# EasyEDA schematic LumaPar.json
TITLE: Parcan Control PCB; REV: 1.0; Date: 2024-01-25; Sheet: 1/1; Company: AHSFA
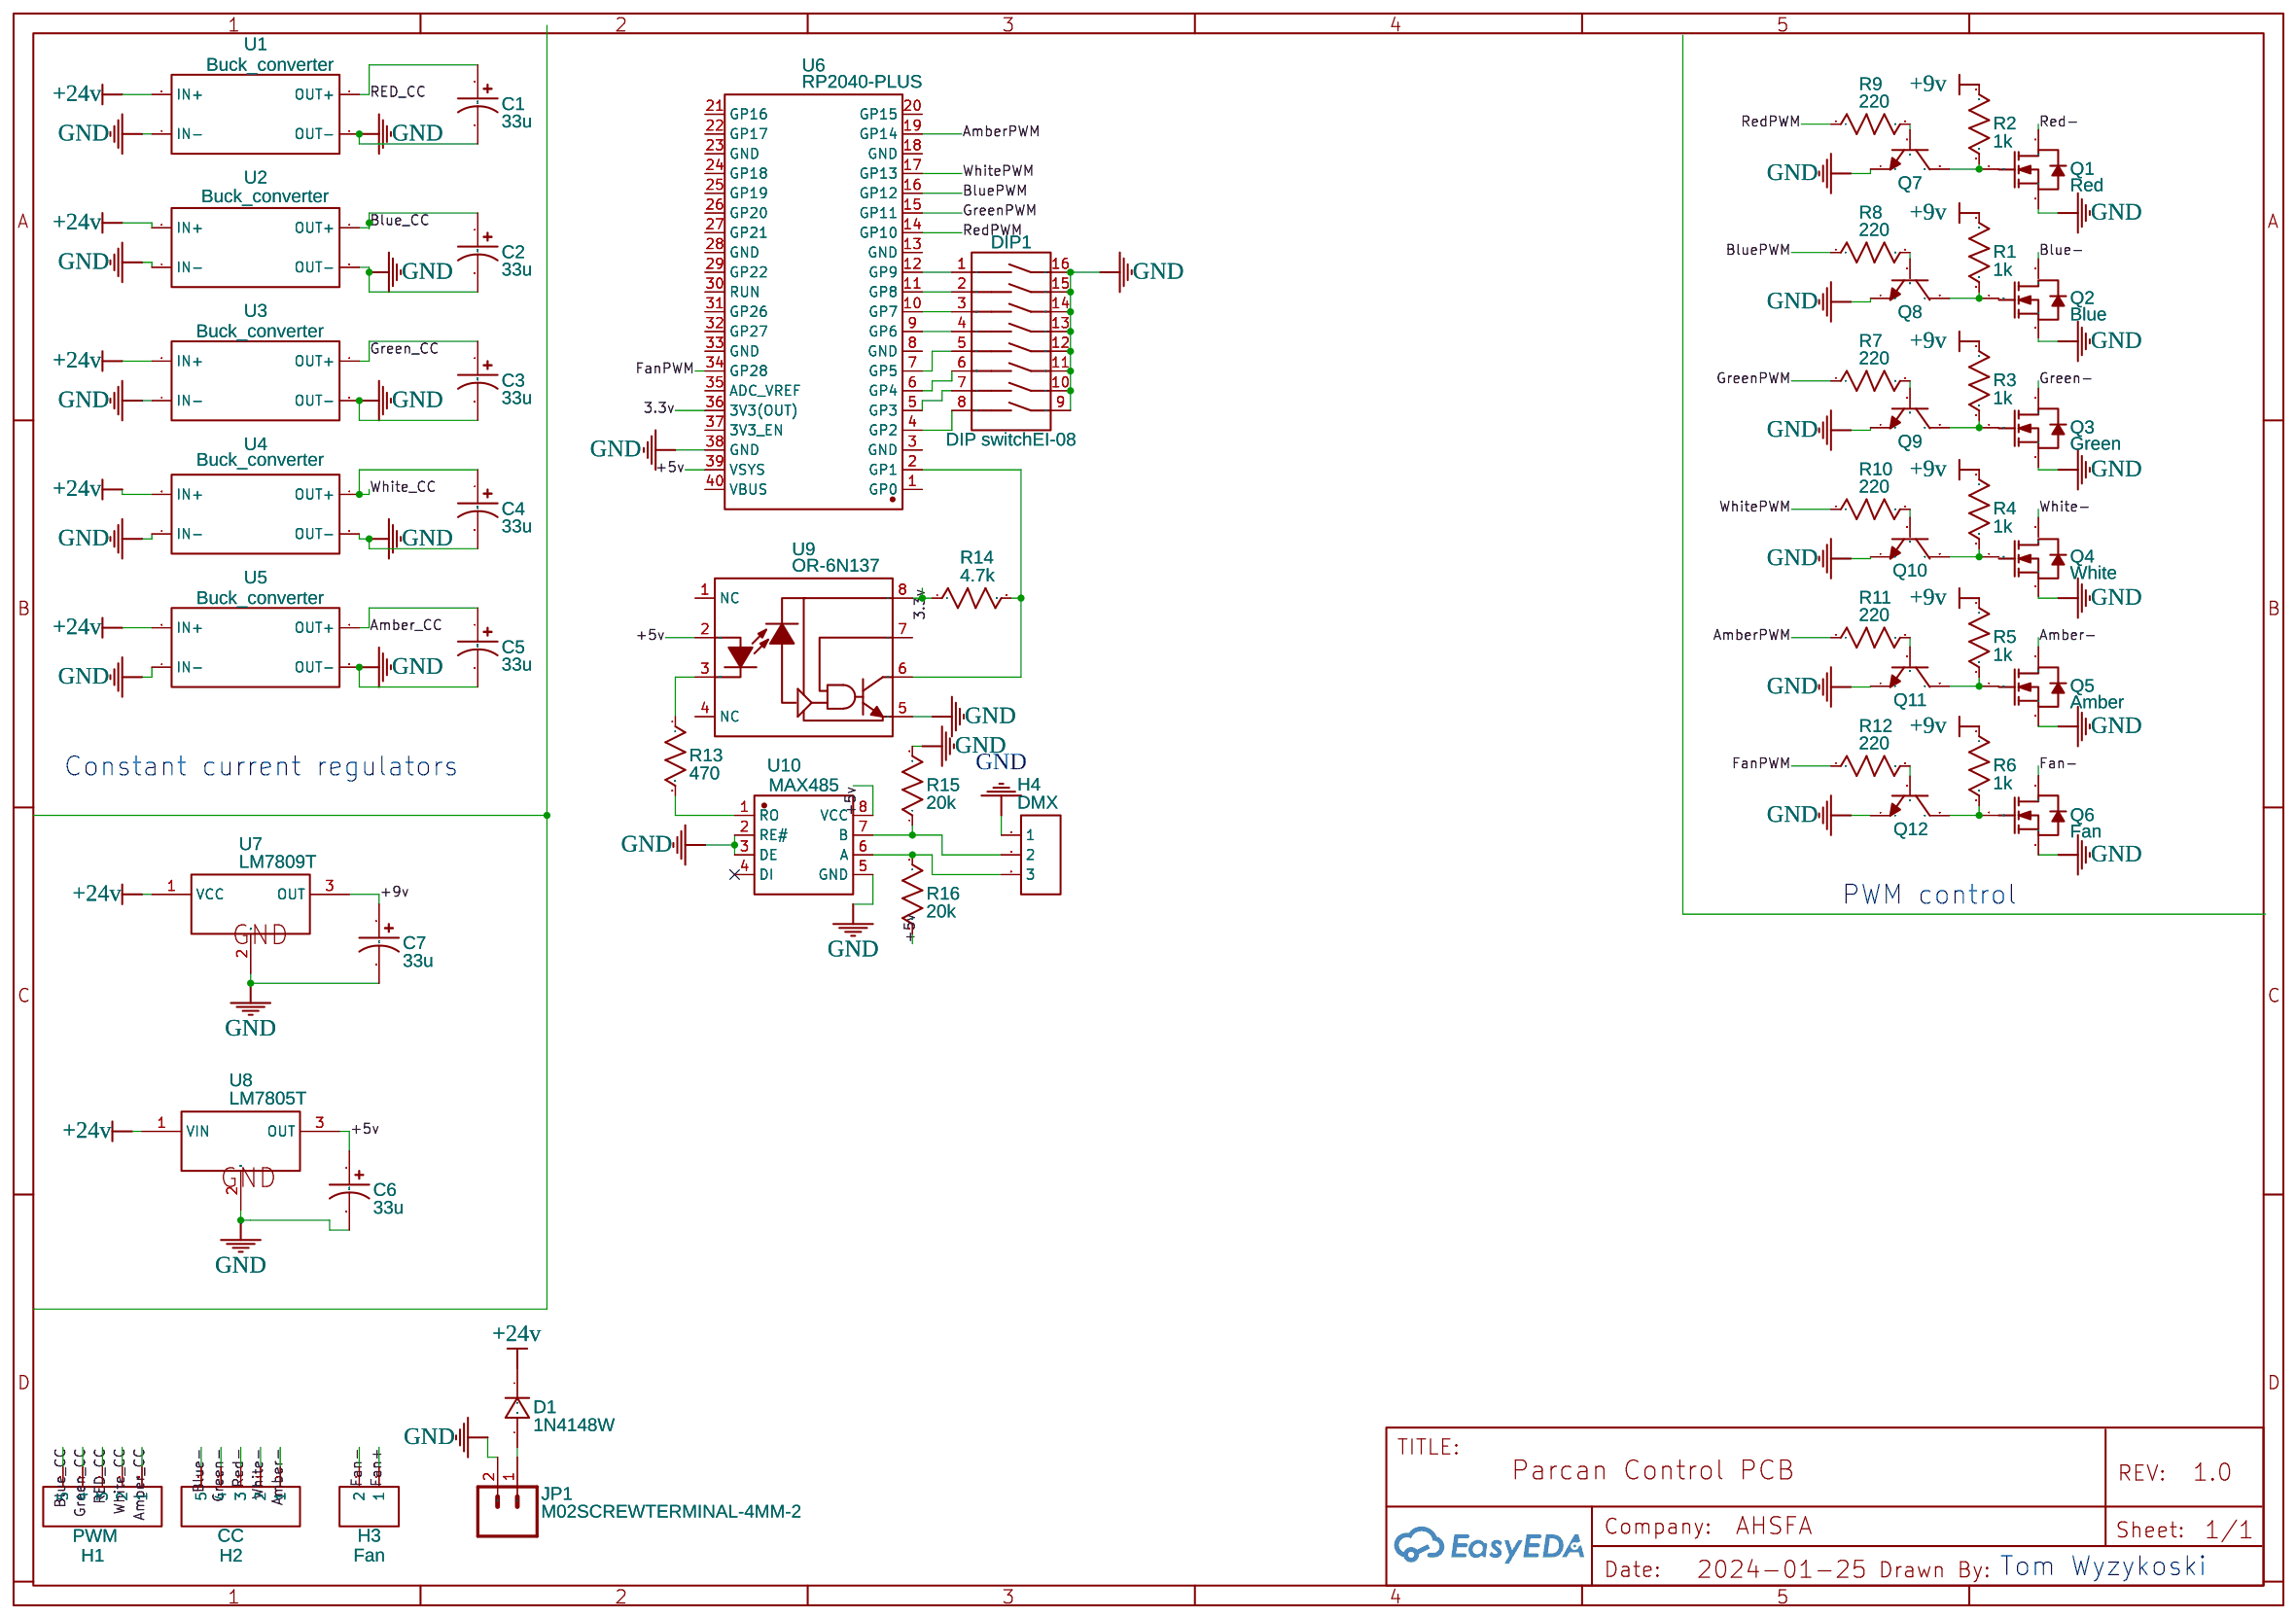
[diagram p0: schematic sheet]

## Parts
C1  33u  [CAP-D5.0×F2.0]
C2  33u  [CAP-D5.0×F2.0]
C3  33u  [CAP-D5.0×F2.0]
C4  33u  [CAP-D5.0×F2.0]
C5  33u  [CAP-D5.0×F2.0]
C6  33u  [CAP-D5.0×F2.0]
C7  33u  [CAP-D5.0×F2.0]
D1  1N4148W  [DO7]
DIP1  DIP switchEI-08  [SW-TH_16P-L20.5-W6.0-P2.54]
H1  PWM  [HDR-F-2.54_1X5]
H2  CC  [HDR-F-2.54_1X5]
H3  Fan  [HDR-F-2.54_1X2]
H4  DMX  [HDR-F-2.54_1X3]
JP1  M02SCREWTERMINAL-4MM-2  [SCREWTERMINAL-4MM-2]
Q1  Red  [D2PAK_L10.0-W9.0-P2.54-LS15.0-BR]
Q2  Blue  [D2PAK_L10.0-W9.0-P2.54-LS15.0-BR]
Q3  Green  [D2PAK_L10.0-W9.0-P2.54-LS15.0-BR]
Q4  White  [D2PAK_L10.0-W9.0-P2.54-LS15.0-BR]
Q5  Amber  [D2PAK_L10.0-W9.0-P2.54-LS15.0-BR]
Q6  Fan  [D2PAK_L10.0-W9.0-P2.54-LS15.0-BR]
Q7  SS8050_C717455  [TO-92-3_L4.9-W3.7-P1.27-L]
Q8  SS8050_C717455  [TO-92-3_L4.9-W3.7-P1.27-L]
Q9  SS8050_C717455  [TO-92-3_L4.9-W3.7-P1.27-L]
Q10  SS8050_C717455  [TO-92-3_L4.9-W3.7-P1.27-L]
Q11  SS8050_C717455  [TO-92-3_L4.9-W3.7-P1.27-L]
Q12  SS8050_C717455  [TO-92-3_L4.9-W3.7-P1.27-L]
R1  1k  [R_AXIAL-0.4]
R2  1k  [R_AXIAL-0.4]
R3  1k  [R_AXIAL-0.4]
R4  1k  [R_AXIAL-0.4]
R5  1k  [R_AXIAL-0.4]
R6  1k  [R_AXIAL-0.4]
R7  220  [R_AXIAL-0.4]
R8  220  [R_AXIAL-0.4]
R9  220  [R_AXIAL-0.4]
R10  220  [R_AXIAL-0.4]
R11  220  [R_AXIAL-0.4]
R12  220  [R_AXIAL-0.4]
R13  470  [R_AXIAL-0.4]
R14  4.7k  [R_AXIAL-0.4]
R15  20k  [R_AXIAL-0.4]
R16  20k  [R_AXIAL-0.4]
U1  Buck_converter  [BUCK-CONVERTER]
U2  Buck_converter  [BUCK-CONVERTER]
U3  Buck_converter  [BUCK-CONVERTER]
U4  Buck_converter  [BUCK-CONVERTER]
U5  Buck_converter  [BUCK-CONVERTER]
U6  RP2040-PLUS  [LCC-40_L51.0-W21.0-P2.54-BL_RP2040-BASED]
U7  LM7809T  [TO-220-3_L10.0-W4.5-P2.54-L]
U8  LM7805T  [TO-220-3_L10.0-W4.5-P2.54-L]
U9  OR-6N137  [DIP-8_L9.7-W6.5-P2.54-LS7.6-BL]
U10  MAX485  [PDIP-8_L9.3-W6.4-P2.54-LS7.9-BL-1]

## Library data of the parts
C1-C7 = CE_TH_D5.0×F2.0_US: Contributor: LCEDA_Lib
D1 = 1N4148W: Supplier: LCSC; Manufacturer: Tak Cheong; Contributor: LCEDA_Lib; Supplier Part: C129216
DIP1 = DIP switchEI-08: Supplier: LCSC; Manufacturer: 圜达; Manufacturer Part: EI-08-V; Supplier Part: C90019; JLCPCB Part Class: Extended Part
H1 H2 = HDR-F-2.54_1x5: Supplier Part: C50950; Supplier: LCSC; Contributor: LCEDA_Lib
H3 = HDR-F-2.54_1x2: Supplier Part: C49661; Supplier: LCSC; Contributor: LCEDA_Lib
H4 = HDR-F-2.54_1x3: Supplier Part: C146690; Supplier: LCSC; Contributor: LCEDA_Lib
JP1 = M02SCREWTERMINAL-4MM-2: Contributor: arg123dt
Q1-Q6 = IRLZ44NSTRLPBF: Contributor: LCSC; Supplier: LCSC; Supplier Part: C538199; Manufacturer: Infineon(英飞凌); JLCPCB Part Class: Extended Part
Q7-Q12 = SS8050_C717455: Contributor: LCSC; Supplier: LCSC; Supplier Part: C717455; Manufacturer: LGE(鲁光); Manufacturer Part: SS8050; JLCPCB Part Class: Extended Part
R1-R12 = R_0603_US: Contributor: LCEDA_Lib
R13-R16 = R_AXIAL-1.0_US: Contributor: LCEDA_Lib
U1-U5 = Buck_converter: Supplier: Tayda; Contributor: J.cruz
U6 = RP2040-PLUS: Supplier: LCSC; Supplier Part: C5374681; Manufacturer: Waveshare(微雪电子); Manufacturer Part: RP2040-Plus; JLCPCB Part Class: Extended Part
U7 = LM7809T: Contributor: LCSC; Supplier: LCSC; Supplier Part: C507141; Manufacturer: HGSEMI(华冠); JLCPCB Part Class: Extended Part
U8 = LM7805T: Contributor: LCSC; Supplier: LCSC; Supplier Part: C507145; Manufacturer: HGC(华冠); JLCPCB Part Class: Extended Part
U9 = OR-6N137: Contributor: LCSC; Supplier: LCSC; Supplier Part: C282486; Manufacturer: Orient(奥伦德); JLCPCB Part Class: Extended Part
U10 = MAX485MJA/883B: Supplier: LCSC; Supplier Part: C18165248; Manufacturer: ADI(亚德诺); Contributor: lcsc

## Nets
3.3v: R14.1 U6.36(3V3(OUT)) U9.8(VCC)
+5v: C6.1 R16.2 U6.39(VSYS) U8.3(OUT) U9.2(ANODE) U10.8(VCC)
+9v: C7.1 R1.1 R2.1 R3.1 R4.1 R5.1 R6.1 U7.3(OUT)
+24v: D1.A(1) U1.3(IN+) U2.3(IN+) U3.3(IN+) U4.3(IN+) U5.3(IN+) U7.1(VCC) U8.1(VIN)
GND: C1.2 C2.2 C3.2 C4.2 C5.2 C6.2 C7.2 DIP1.9 DIP1.10 DIP1.11 DIP1.12 DIP1.13 DIP1.14 DIP1.15 DIP1.16 H4.1 JP1.2 Q1.3(S) Q2.3(S) Q3.3(S) Q4.3(S) Q5.3(S) Q6.3(S) Q7.1(E) Q8.1(E) Q9.1(E) Q10.1(E) Q11.1(E) Q12.1(E) R15.2 U1.2(OUT-) U1.4(IN-) U2.2(OUT-) U2.4(IN-) U3.2(OUT-) U3.4(IN-) U4.2(OUT-) U4.4(IN-) U5.2(OUT-) U5.4(IN-) U6.38(GND) U7.2(GND) U8.2(GND) U9.5(GND) U10.2(RE#) U10.3(DE) U10.5(GND)
Amber-: H2.1 Q5.2(D)
Amber_CC: C5.1 H1.1 U5.1(OUT+)
AmberPWM: R11.1 U6.19(GP14)
Blue-: H2.5 Q2.2(D)
Blue_CC: C2.1 H1.5 U2.1(OUT+)
BluePWM: R8.1 U6.16(GP12)
Fan+: H3.1
Fan-: H3.2 Q6.2(D)
FanPWM: R12.1 U6.34(GP28)
Green-: H2.4 Q3.2(D)
Green_CC: C3.1 H1.4 U3.1(OUT+)
GreenPWM: R7.1 U6.15(GP11)
Red-: H2.3 Q1.2(D)
RED_CC: C1.1 H1.3 U1.1(OUT+)
RedPWM: R9.1 U6.14(GP10)
White-: H2.2 Q4.2(D)
White_CC: C4.1 H1.2 U4.1(OUT+)
WhitePWM: R10.1 U6.17(GP13)
Net-(D1-K): D1.K(2) JP1.1
Net-(DIP1-1): DIP1.1 U6.12(GP9)
Net-(DIP1-2): DIP1.2 U6.11(GP8)
Net-(DIP1-3): DIP1.3 U6.10(GP7)
Net-(DIP1-4): DIP1.4 U6.9(GP6)
Net-(DIP1-5): DIP1.5 U6.7(GP5)
Net-(DIP1-6): DIP1.6 U6.6(GP4)
Net-(DIP1-7): DIP1.7 U6.5(GP3)
Net-(DIP1-8): DIP1.8 U6.4(GP2)
Net-(H4-2): H4.2 R15.1 U10.7(B)
Net-(H4-3): H4.3 R16.1 U10.6(A)
Net-(Q1-1): Q1.1(G) Q7.3(C) R2.2
Net-(Q2-1): Q2.1(G) Q8.3(C) R1.2
Net-(Q3-1): Q3.1(G) Q9.3(C) R3.2
Net-(Q4-1): Q4.1(G) Q10.3(C) R4.2
Net-(Q5-1): Q5.1(G) Q11.3(C) R5.2
Net-(Q6-1): Q6.1(G) Q12.3(C) R6.2
Net-(Q7-2): Q7.2(B) R9.2
Net-(Q8-2): Q8.2(B) R8.2
Net-(Q9-2): Q9.2(B) R7.2
Net-(Q10-2): Q10.2(B) R10.2
Net-(Q11-2): Q11.2(B) R11.2
Net-(Q12-2): Q12.2(B) R12.2
Net-(R13-1): R13.1 U9.3(CATHODE)
Net-(R13-2): R13.2 U10.1(RO)
Net-(R14-2): R14.2 U6.2(GP1) U9.6(VO)

Not connected (* = marked no-connect by the designer): U6 1(GP0) 3(GND) 8(GND) 13(GND) 18(GND) 20(GP15) 21(GP16) 22(GP17) 23(GND) 24(GP18) 25(GP19) 26(GP20) 27(GP21) 28(GND) 29(GP22) 30(RUN) 31(GP26) 32(GP27) 33(GND) 35(ADC_VREF) 37(3V3_EN) 40(VBUS); U9 1(NC) 4(NC) 7(VE); U10 4(DI)*

## Notes on the sheet
- Constant current regulators
- PWM control
- Tom Wyzykoski
